# Altium schematic sheet Sheet4.SchDoc
size A4
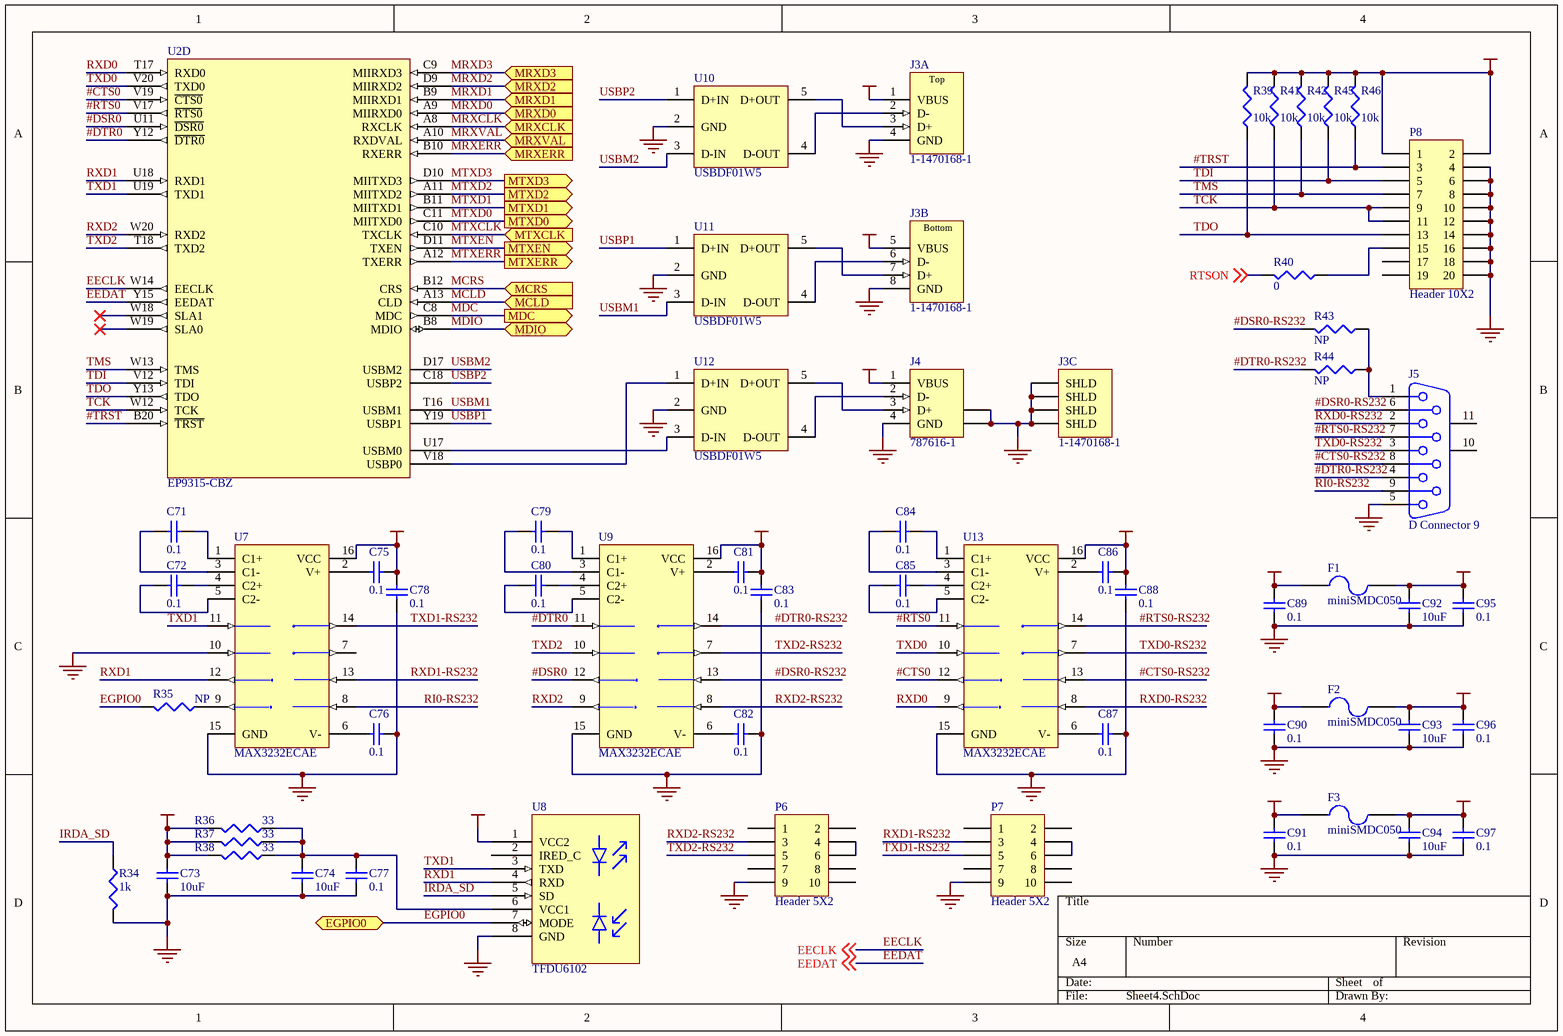
[diagram p0: Sheet4.SchDoc]

## Parts
C71  0.1  [0603]
C72  0.1  [0603]
C73  10uF  [1206]
C74  10uF  [1206]
C75  0.1  [0603]
C76  0.1  [0603]
C77  0.1  [0603]
C78  0.1  [0603]
C79  0.1  [0603]
C80  0.1  [0603]
C81  0.1  [0603]
C82  0.1  [0603]
C83  0.1  [0603]
C84  0.1  [0603]
C85  0.1  [0603]
C86  0.1  [0603]
C87  0.1  [0603]
C88  0.1  [0603]
C89  0.1  [0603]
C90  0.1  [0603]
C91  0.1  [0603]
C92  10uF  [1206]
C93  10uF  [1206]
C94  10uF  [1206]
C95  0.1  [0603]
C96  0.1  [0603]
C97  0.1  [0603]
F1  miniSMDC050  [miniSMDC050]
F2  miniSMDC050  [miniSMDC050]
F3  miniSMDC050  [miniSMDC050]
J3  1-1470168-1  [1470168]  (parts A,B,C of 3)
J4  787616-1  [787616]
J5  D Connector 9  [DSUB1.385-2H9]
P6  Header 5X2  [HDR2X5]
P7  Header 5X2  [HDR2X5]
P8  Header 10X2  [HDR2X10]
R34  1k  [CR1608-0603]
R35  NP  [CR1608-0603]
R36  33  [CR1608-0603]
R37  33  [CR1608-0603]
R38  33  [CR1608-0603]
R39  10k  [CR1608-0603]
R40  0  [CR1608-0603]
R41  10k  [CR1608-0603]
R42  10k  [CR1608-0603]
R43  NP  [CR1608-0603]
R44  NP  [CR1608-0603]
R45  10k  [CR1608-0603]
R46  10k  [CR1608-0603]
U2  EP9315-CBZ  [BGA352x20]  (part D of 4)
U7  MAX3232ECAE  [SSOP16]
U8  TFDU6102  [TFDU_8PIN]
U9  MAX3232ECAE  [SSOP16]
U10  USBDF01W5  [SOT353]
U11  USBDF01W5  [SOT353]
U12  USBDF01W5  [SOT353]
U13  MAX3232ECAE  [SSOP16]

## Ports
EGPIO0 (bidir), MCLD (in), MCRS (in), MDC (out), MDIO (bidir), MRXCLK (in), MRXD0 (in), MRXD1 (in), MRXD2 (in), MRXD3 (in), MRXERR (in), MRXVAL (in), MTXCLK (in), MTXD0 (out), MTXD1 (out), MTXD2 (out), MTXD3 (out), MTXEN (out), MTXERR (out)

## Nets
GND: C73.1 C74.1 C76.1 C77.1 C78.2 C82.1 C83.2 C87.1 C88.2 C89.1 C90.1 C91.1 C92.1 C93.1 C94.1 C95.1 C96.1 C97.1 J3.4(GND) J3.8(GND) J3.9(SHLD) J3.10(SHLD) J3.11(SHLD) J3.12(SHLD) J4.4(GND) J4.5(SHLD) J4.6(SHLD) J5.5 P6.9 P7.9 P8.4 P8.6 P8.8 P8.10 P8.12 P8.14 P8.16 P8.18 P8.20 R34.2 U7.10(T2IN) U7.15(GND) U8.8(GND) U9.15(GND) U10.2(GND) U11.2(GND) U12.2(GND) U13.15(GND)
PWR_USB0: C92.2 C95.2 F1.2 J3.1(VBUS)
PWR_USB1: C93.2 C96.2 F2.2 J3.5(VBUS)
PWR_USB2: C94.2 C97.2 F3.2 J4.1(VBUS)
VCC5V0: C89.2 C90.2 C91.2 F1.1 F2.1 F3.1
VCCIO: C73.2 C75.1 C78.1 C81.1 C83.1 C86.1 C88.1 P8.1 P8.2 R36.2 R37.2 R38.2 R39.2 R41.2 R42.2 R45.2 R46.2 U7.16(VCC) U8.1(VCC2) U9.16(VCC) U13.16(VCC)
#CTS0: U2.V19(~{CTS0}) U13.12(R1OUT)
#CTS0-RS232: J5.8 U13.13(R1IN)
#DSR0: U2.U11(~{DSR0}) U9.12(R1OUT)
#DSR0-RS232: J5.6 R43.2 U9.13(R1IN)
#DTR0: U2.Y12(~{DTR0}) U9.11(T1IN)
#DTR0-RS232: J5.4 R44.2 U9.14(T1OUT)
#RTS0: U2.V17(~{RTS0}) U13.11(T1IN)
#RTS0-RS232: J5.7 U13.14(T1OUT)
#TRST: P8.3 R46.1 U2.B20(~{TRST})
EECLK: U2.W14(EECLK) ; off-sheet EECLK
EEDAT: U2.Y15(EEDAT) ; off-sheet EEDAT
EGPIO0: R35.2 U8.7(MODE) ; port EGPIO0
IRDA_SD: R34.1 U8.5(SD)
MCLD: U2.A13(CLD) ; port MCLD
MCRS: U2.B12(CRS) ; port MCRS
MDC: U2.C8(MDC) ; port MDC
MDIO: U2.B8(MDIO) ; port MDIO
MRXCLK: U2.A8(RXCLK) ; port MRXCLK
MRXD0: U2.A9(MIIRXD0) ; port MRXD0
MRXD1: U2.B9(MIIRXD1) ; port MRXD1
MRXD2: U2.D9(MIIRXD2) ; port MRXD2
MRXD3: U2.C9(MIIRXD3) ; port MRXD3
MRXERR: U2.B10(RXERR) ; port MRXERR
MRXVAL: U2.A10(RXDVAL) ; port MRXVAL
MTXCLK: U2.C10(TXCLK) ; port MTXCLK
MTXD0: U2.C11(MIITXD0) ; port MTXD0
MTXD1: U2.B11(MIITXD1) ; port MTXD1
MTXD2: U2.A11(MIITXD2) ; port MTXD2
MTXD3: U2.D10(MIITXD3) ; port MTXD3
MTXEN: U2.D11(TXEN) ; port MTXEN
MTXERR: U2.A12(TXERR) ; port MTXERR
RI0-RS232: J5.9 U7.8(R2IN)
RTSON: R40.2 ; off-sheet RTSON
RXD0: U2.T17(RXD0) U13.9(R2OUT)
RXD0-RS232: J5.2 U13.8(R2IN)
RXD1: U2.U18(RXD1) U7.12(R1OUT) U8.4(RXD)
RXD1-RS232: P7.3 U7.13(R1IN)
RXD2: U2.W20(RXD2) U9.9(R2OUT)
RXD2-RS232: P6.3 U9.8(R2IN)
TCK: P8.9 P8.11 R41.1 U2.W12(TCK)
TDI: P8.5 R45.1 U2.V12(TDI)
TDO: P8.13 R39.1 U2.Y13(TDO)
TMS: P8.7 R42.1 U2.W13(TMS)
TXD0: U2.V20(TXD0) U13.10(T2IN)
TXD0-RS232: J5.3 U13.7(T2OUT)
TXD1: U2.U19(TXD1) U7.11(T1IN) U8.3(TXD)
TXD1-RS232: P7.5 U7.14(T1OUT)
TXD2: U2.T18(TXD2) U9.10(T2IN)
TXD2-RS232: P6.5 U9.7(T2OUT)
USBM1: U2.T16(USBM1) U11.3(D-IN)
USBM2: U2.D17(USBM2) U10.3(D-IN)
USBP1: U2.Y19(USBP1) U11.1(D+IN)
USBP2: U2.C18(USBP2) U10.1(D+IN)
NetC71_1: C71.1 U7.1(C1+)
NetC71_2: C71.2 U7.3(C1-)
NetC72_1: C72.1 U7.4(C2+)
NetC72_2: C72.2 U7.5(C2-)
NetC74_2: C74.2 C77.2 R36.1 R37.1 R38.1 U8.6(VCC1)
NetC75_2: C75.2 U7.2(V+)
NetC76_2: C76.2 U7.6(V-)
NetC79_1: C79.1 U9.1(C1+)
NetC79_2: C79.2 U9.3(C1-)
NetC80_1: C80.1 U9.4(C2+)
NetC80_2: C80.2 U9.5(C2-)
NetC81_2: C81.2 U9.2(V+)
NetC82_2: C82.2 U9.6(V-)
NetC84_1: C84.1 U13.1(C1+)
NetC84_2: C84.2 U13.3(C1-)
NetC85_1: C85.1 U13.4(C2+)
NetC85_2: C85.2 U13.5(C2-)
NetC86_2: C86.2 U13.2(V+)
NetC87_2: C87.2 U13.6(V-)
NetJ3_2: J3.2(D-) U10.4(D-OUT)
NetJ3_3: J3.3(D+) U10.5(D+OUT)
NetJ3_6: J3.6(D-) U11.4(D-OUT)
NetJ3_7: J3.7(D+) U11.5(D+OUT)
NetJ4_2: J4.2(D-) U12.4(D-OUT)
NetJ4_3: J4.3(D+) U12.5(D+OUT)
NetJ5_1: J5.1 R43.1 R44.1
NetP6_4: P6.4 P6.6
NetP7_4: P7.4 P7.6
NetP8_15: P8.15 R40.1
NetR35_1: R35.1 U7.9(R2OUT)
NetU2_U17: U2.U17(USBM0) U12.3(D-IN)
NetU2_V18: U2.V18(USBP0) U12.1(D+IN)

Not connected (* = marked no-connect by the designer): J5 10(MH1) 11(MH2); P6 1 2 7 8 10; P7 1 2 7 8 10; P8 17 19; U2 W18(SLA1)* W19(SLA0)*; U7 7(T2OUT); U8 2(IRED_C)

## Notes on the sheet
- (in symbol 1-1470168-1, part A) Top
- (in symbol 1-1470168-1, part B) Bottom

## Library data of the parts
C71 C72 C75-C91 C95-C97 = C0603: Ceramic Chip Capacitor - Standard; Note: Footprint corresponds to dimensions for bulk cassette packaging. This case size has tightened tolerances.; Published: 17-Jul-2002; LatestRevisionDate: 19-Mar-2004; LatestRevisionNote: Silkscreen size reduced.; DatasheetDocument: Mar-2001; PackageDocument: Mar-2001; PackageReference: 0603; Publisher: Altium Limited; Code_JEITA: 0603; Code_IPC: 1608 [0603]; ComponentLink1Description: Manufacturer Link; ComponentLink1URL: http://www.kemet.com/; ComponentLink2Description: Datasheet; ComponentLink2URL: http://www.kemet.com/kemet/web/homepage/kechome.nsf/vapubfilesname/F3102TA.pdf/$file/F3102TA.pdf; Value: 0.1
C73 C74 C92-C94 = C1206: Ceramic Chip Capacitor - Standard; Published: 17-Jul-2002; LatestRevisionDate: 19-Mar-2004; LatestRevisionNote: Silkscreen size reduced.; DatasheetDocument: Mar-2001; PackageDocument: Mar-2001; PackageReference: 1206; Publisher: Altium Limited; Code_JEITA: 1206; Code_IPC: 3216 [1206]; ComponentLink1Description: Manufacturer Link; ComponentLink1URL: http://www.kemet.com/; ComponentLink2Description: Datasheet; ComponentLink2URL: http://www.kemet.com/kemet/web/homepage/kechome.nsf/vapubfilesname/F3102TA.pdf/$file/F3102TA.pdf; Value: 10uF
F1-F3 = miniSMDC050: miniSMDC050 Fuse component
J3 = 1-1470168-1: USB 1.1, Right Angle, Thru-Hole, A Type, Receptacle, 4x4 Position, Stacked, Black; ContactMaterial: Copper Alloy; ContactPlating: Gold Flash; TerminationLength: 3.18mm [0.125in.]; PCB_Layout: Complies with manufacturer's recommendation.; DrillSize: Corresponds to nominal value.; PanelGround: With; Published: 15-Jul-2004; DatasheetDocument: 15-Aug-2002; PackageDocument: 15-Aug-2002; PackageReference: 1470168; Publisher: Altium Limited; ComponentLink1Description: Manufacturer Link; ComponentLink1URL: http://www.tycoelectronics.com/; HousingMaterial: Glass-Filled Thermoplastic
J4 = 787616-1: USB 1.1, Right Angle, Thru-Hole, A Type, Receptacle, 4 Position, Black; Note: Directive 2000/53/EC (ELV) Compliant; ContactMaterial: Copper Alloy; ContactPlating: Gold (30) over Palladium Nickel; TerminationLength: 2.84mm [0.112in.]; PCB_Layout: Complies with manufacturer's recommendation.; DrillSize: Corresponds to nominal value.; PanelGround: Without; Published: 15-Jul-2004; DatasheetDocument: 11-Jan-2004; PackageDocument: 11-Jan-2004; PackageReference: 787616; Publisher: Altium Limited; HousingMaterial: Thermoplastic
J5 = D Connector 9: Receptacle Assembly, 9 Position, Right Angle; PackageDocument: O; Positions: 9; Published: 15-Jun-2001; LatestRevisionDate: 17-Jul-2002; LatestRevisionNote: Re-released for DXP Platform.; DatasheetDocument: 1-Sep-1999; PackageReference: 788750; Publisher: Altium Limited; Orientation: Right Angle; Gender: Receptacle
P6 P7 = Header 5X2: Header, 5-Pin, Dual row; LatestRevisionDate: 17-Jul-2002; LatestRevisionNote: Re-released for DXP Platform.; Publisher: Altium Limited
P8 = Header 10X2: Header, 10-Pin, Dual row; Revision: 17-Jul-2002: Re-released for DXP Platform.; Publisher: Altium Limited
R34-R46 = Res3: Resistor; Published: 8-Jun-2000; Revision: July-2002: Re-released for DXP Platform.; Publisher: Altium Limited
  R34: Value: 1k
  R35 R43 R44: Value: NP
  R36-R38: Value: 33
  R39 R41 R42 R45 R46: Value: 10k
  R40: Value: 0
U2 = EP9315-CBZ: 32 Bit ARM920T Microcontroller with inegrated graphics, IDE, PCMCIA, Ethernet
U7 U9 U13 = MAX3232ECAE: ±15kV ESD-Protected, 3.0V to 5.5V, Low-Power, up to 250kbps, True RS-232 Transceiver; PackageDocument: 1996; Published: 16-Jan-2001; LatestRevisionDate: 6-Jun-2005; LatestRevisionNote: Stylized 3D Model Added.; DatasheetDocument: Mar-1999; PackageReference: SSOP16; Publisher: Altium Limited; ComponentLink1Description: Manufacturer Link; ComponentLink1URL: http://www.maxim-ic.com/; ComponentLink2Description: Datasheet; ComponentLink2URL: http://pdfserv.maxim-ic.com/en/ds/MAX3222E-MAX3246E.pdf
U8 = TFDU6102: Fast Infrared Transceiver Module (FIR, 4 Mbit/s)
U10-U12 = USBDF01W5: EMI FILTER AND LINE TERMINATION  FOR USB DOWNSTREAM PORTS